# Altium schematic sheet 20Vvoeding.SchDoc
size A4; SheetNumber: 2; SheetTotal: 5
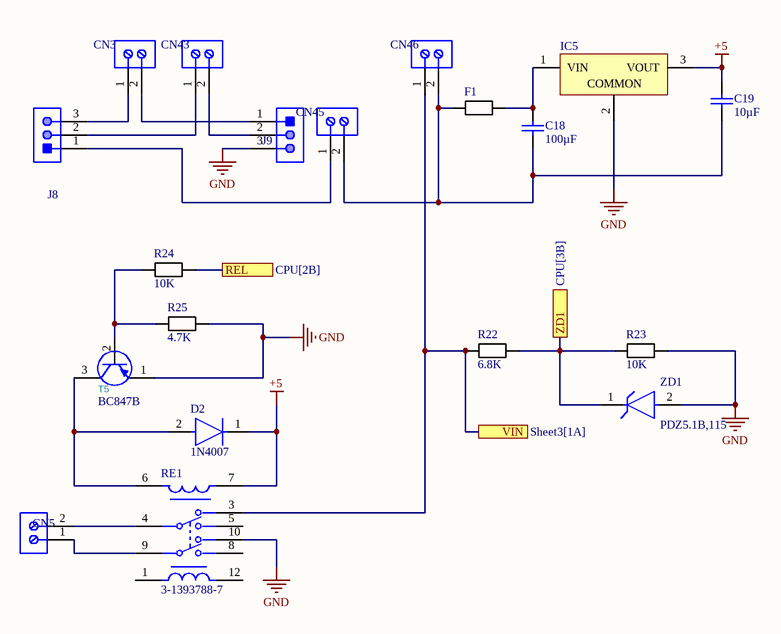
[diagram p0: 20Vvoeding.SchDoc]

## Parts
C18  100µF  [CAPACITOR]
C19  10µF  [CAPACITOR]
CN3  1725656  [PHOE-1725656-2]  (value not drawn)
CN5  1725656  [PHOE-1725656-2]  (value not drawn)
CN43  1725656  [PHOE-1725656-2]  (value not drawn)
CN45  1725656  [PHOE-1725656-2]  (value not drawn)
CN46  1725656  [PHOE-1725656-2]  (value not drawn)
D2  1N4007  [FP-1N4001-E3-54-MFG]
F1  (no value)  [CAPC2013X94X50ML20T25]
IC5  OKI-78SR-5/1.5-W36-C  [MURA-OKI-78SR-3]  (value not drawn)
J8  B3B-PH-K-S(LF)(SN)  [JST-B3B-PH-K-S-3_V]  (value not drawn)
J9  B3B-PH-K-S(LF)(SN)  [JST-B3B-PH-K-S-3_V]  (value not drawn)
R22  6.8K  [CAPC2013X94X50ML20T25]
R23  10K  [CAPC2013X94X50ML20T25]
R24  10K  [CAPC2013X94X50ML20T25]
R25  4.7K  [CAPC2013X94X50ML20T25]
RE1  3-1393788-7  [FP-3-1393788-7-MFG]
T5  BC847B  [SOT-23]
ZD1  PDZ5.1B,115  [FP-SOD323-MFG]

## Ports
REL (see CPU[2B]), VIN (see Sheet3[1A]), ZD1 (see CPU[3B])

## Nets
+5: C19.2 D2.1(C) IC5.3(VOUT) RE1.7(reset-/set+)
GND: IC5.2(COMMON) J9.3 R23.2 R25.2 RE1.10 T5.1(C) ZD1.2(A)
REL: R24.2 ; port REL
VIN: CN46.1 R22.1 RE1.3 ; port VIN
ZD1: R22.2 R23.1 ZD1.1(C) ; port ZD1
NetC18_1: C18.1 C19.1 CN45.2 CN46.2 F1.1
NetC18_2: C18.2 F1.2 IC5.1(VIN)
NetCN3_1: CN3.1 J8.3
NetCN3_2: CN3.2 J9.1
NetCN5_1: CN5.1 RE1.9
NetCN5_2: CN5.2 RE1.4
NetCN43_1: CN43.1 J8.2
NetCN43_2: CN43.2 J9.2
NetCN45_1: CN45.1 J8.1
NetD2_2: D2.2(A) RE1.6(reset+/set-) T5.3(E)
NetR24_1: R24.1 R25.1 T5.2(B)

Not connected (* = marked no-connect by the designer): RE1 1(set+/reset-) 5 8 12(set-/reset+)

## Library data of the parts
C18 C19 = CMP-2006-02592-1: Part Number: GRM1885C1H100JA01D; Manufacturer: Murata
CN3 CN5 CN43 CN45 CN46 = CMP-2000-05299-1: Male Header, Pitch 2.54 mm, 1 x 2 Position, Height 9 mm, Tail Length 3.5 mm; Manufacturer: Phoenix Contact; Number of contacts: 2; Content: 250pc(s); Pitch: 2.54mm; Industrial packaging: Yes; Colour: Green; Manufacturer part No.: 1725656; Type: MPT0,5/2-2,54; Datasheet URL: http://datasheet.octopart.com/1725656-Phoenix-Contact-datasheet-5302866.pdf; Manufacturer URL: http://www.phoenixcontact.com/; Datasheet Version: Apr-08
D2 = Diode: DIODE GEN PURP 50V 1A DO204AL; Max Surge Current: 30A; Forward Voltage: 1.1V; Capacitance: 15pF; Peak Non-Repetitive Surge Current: 45A; Polarity: Standard; Max Reverse Current: 5uA; Element Configuration: Single; Length: 0.204inch; Diameter: 2.7mm; Mount: Through Hole; Package Quantity: 5500; Series: -; Radiation Hardening: No; Width: 2.7mm; Max Forward Surge Current (Ifsm): 30A; Average Rectified Current: 1A; Voltage: 50V; Current Rating: 1A; Height: 2.7mm; Forward Current: 1A; Lead Free: Lead Free; Min Operating Temperature: -50°C; Number of Pins: 2; RoHS Compliant: Yes; Packaging: Tape and Reel; Current: 1A; Max Reverse Voltage (DC): 50V; Output Current: 1A; Reverse Voltage: 50V; Case/Package: DO-204AL; Max Repetitive Reverse Voltage (Vrrm): 50V; Voltage Rating (DC): 50V; Max Operating Temperature: 150°C
F1 R22-R25 = Resistor: Manufacturer: Vishay Dale; Part Number: CRCW08050000Z0EA
IC5 = CMP-2000-05274-1: Non-Isolated DC/DC Converter, 7.5 W, 7 to 36 V, 1.5 A, -40 to 85 degC, 3-Pin THD, RoHS; Manufacturer: Murata; Current - Output (Max): 1.5A; Power (Watts) - Max: 8W; Efficiency: 90.5%; Voltage - Input (Min): 7V; Voltage - Input (Max): 36V; Voltage - Output 1: 5V; Number of Outputs: 1; Package / Case: 3-SIPModule; Features: SCP; Type: LinearRegulatorReplacement; Size / Dimension: 0.41"Lx0.30"Wx0.65"H(10.4mmx7.6mmx16.5mm); Datasheet URL: https://datasheet.ciiva.com/8006/1790439-8006672.pdf; Datasheet Version: Oct-13; Power (Watts) - Manufacture Series: 8W; Voltage - Output 2: -; Series: Okami™OKI-78SR; Family: DCDCConverters; Manufacturer URL: http://www.murata.com/; Category: PowerSupplies-BoardMount; Voltage - Isolation: -; Packaging: Tube; Applications: ITE(Commercial); Mounting Type: ThroughHole; Voltage - Output 3: -; Operating Temperature: -40degC~85degC
J8 J9 = CMP-2000-05164-1: Male Header, Pitch 2 mm, 1 x 3 Position, Height 6 mm, Tail Length 3.4 mm, -25 to 85 degC, RoHS, Bulk; Manufacturer: JST; Style/Orientation: StraightHeader/Plug; Pitch: 2mm; No of Positions: 3; Termination: Crimp; Manufacturer URL: http://www.jst.com/home2.html; Datasheet Version: Oct-06; Type: ShroudedHeader; Datasheet URL: https://datasheet.ciiva.com/11746/0900766b80826550-11746939.pdf
RE1 = CMP-03396-000003-1: RELAY GEN PURPOSE DPDT 2A 24VDC; Manufacturer: TE Connectivity; Switching Current: 5A; Coil Power: 140mW; Switching Power: 60W; Standoff Height: 0.4mm; Coil Resistance: 4114Ω; Number Of Contacts: 2; Coil Type: Latching and Dual Coil; Coil Voltage: 24V; Description: General Purpose Relay DPDT (2 Form C) Through Hole; Height: 9.9mm; ComponentLink2Description: Datasheet; Device Class L3: Signal Relays; Automotive: No; Digikey Description: RELAY GEN PURPOSE DPDT 2A 24VDC; Lead Free: Yes; Throw Configuration: DPDT; Temperature: -40°C to +85°C; Octopart: https://octopart.com/3-1393788-7-te+connectivity-40402382; Manufacturer Part Number: 3-1393788-7; Ambient Temperature Range Low: -40°C; Category: Relay; Ambient Temperature Range High: +85°C; Device Class L1: Electromechanical; Temperature Range High: +85°C; Package: 3-1393788-7; Temperature Range Low: -40°C; Device Class L2: Relays; ComponentLink2URL: https://www.te.com/usa-en/product-3-1393788-7.html?te_bu=Cor&te_type=other&te_campaign=oct_glo_cor-oct-global-oth-prtnr-fy19-oct-octo-buy-bom_sma-298_2&elqCampaignId=35216; RoHS: TRUE; Current Rating: 2A
T5 = Dual-Diode_CA: ki_keywords: Dual Diode Common Anode; ki_description: Dual Diode Common Anode
ZD1 = CMP-14400-000016-1: DIODE ZENER 5.1V 400MW SOD323